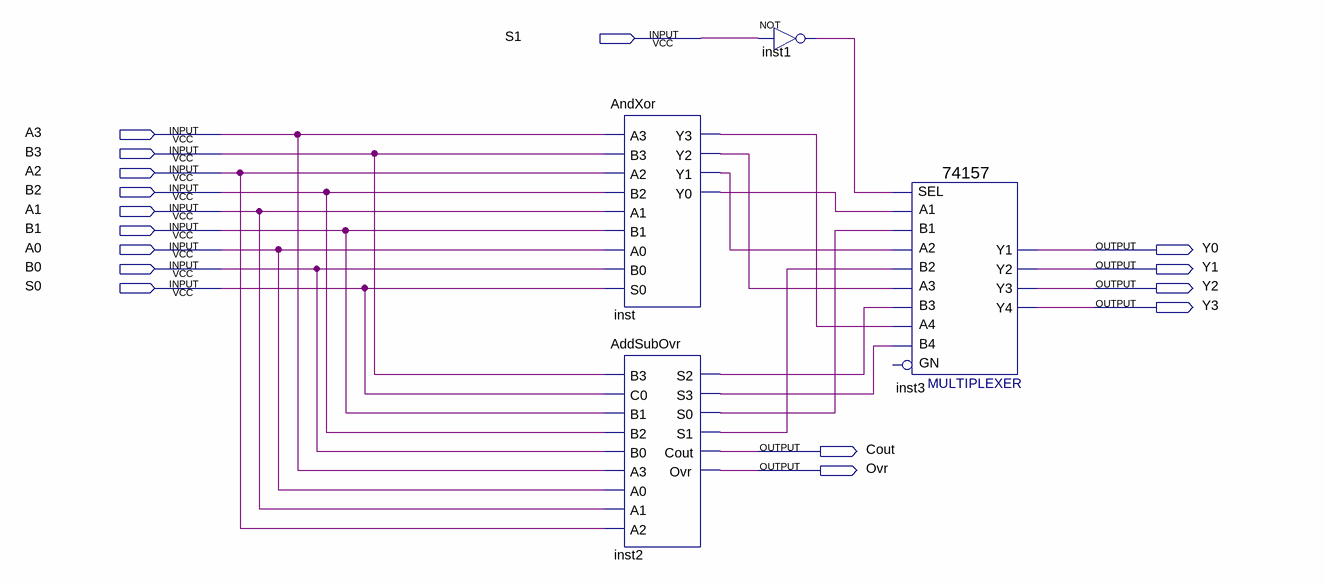
[diagram p0: schematic sheet]
// Quartus schematic ALU.bdf as structural Verilog: 4 symbols, 16 pins
module ALU (
  input  S1,
  input  A3,
  input  B3,
  input  A2,
  input  B2,
  input  A1,
  input  B1,
  input  A0,
  input  B0,
  input  S0,
  output Y0,
  output Y1,
  output Y2,
  output Y3,
  output Cout,
  output Ovr
);

  wire inst1_out, inst2_s0, inst2_s1, inst2_s2, inst2_s3, inst_y0, inst_y1, inst_y2, inst_y3;

  AndXor inst (
    .A3(A3), .B3(B3), .A2(A2), .B2(B2), .A1(A1), .B1(B1), .A0(A0), .B0(B0), .S0(S0), .Y3(inst_y3),
    .Y2(inst_y2), .Y1(inst_y1), .Y0(inst_y0));
  AddSubOvr inst2 (
    .B3(B3), .C0(S0), .B1(B1), .B2(B2), .B0(B0), .A3(A3), .A0(A0), .A1(A1), .A2(A2), .S2(inst2_s2),
    .S3(inst2_s3), .S0(inst2_s0), .S1(inst2_s1), .Cout(Cout), .Ovr(Ovr));
  not inst1 (inst1_out, S1);
  \74157  inst3 (
    .A1(inst_y0), .B1(inst2_s0), .SEL(inst1_out), .B2(inst2_s1), .A3(inst_y2), .B3(inst2_s2), .A2(inst_y1),
    .B4(inst2_s3), .A4(inst_y3), .Y2(Y1), .Y1(Y0), .Y4(Y3), .Y3(Y2));  // open: GN
endmodule
